# Altium schematic sheet BLDC_Hardware.SchDoc
size B; Date: Not shown in title block; ApprovedBy: Not shown in title block; CheckedBy: Not shown in title block; Author: Not shown in title block; CompanyName: Not shown in title block; DrawnBy: Erhan YILMAZ; Engineer: Not shown in title block; Organization: Not shown in title block; Address1: Not shown in title block; Address2: Not shown in title block; Address3: Not shown in title block; Address4: Not shown in title block; DocumentNumber: 2; Revision: 1; SheetNumber: 2; SheetTotal: 4; PageSetup: Record=PageOptions|CenterHorizontal=True|CenterVertical=True|PrintScale=1.00|XCorrection=1.00|YCorrection=1.00|PrintKind=0|BorderSize=5000000|LeftOffset=0|BottomOffset=0|Orientation=2|PaperLength=1000|PaperWidth=1000|Scale=100|PaperSource=15|PrintQuality=600|MediaType=1|DitherType=10|PaperKind=Letter|PrintScaleMode=1; LogoLocation: C:\Users\erhan\Desktop\emob_bldc\design\hardware\altium\templates\schematic\Beuth-Logo.bmp; SheetTitle: Mechanic Parts; DesignedBy: Erhan YILMAZ; PRJNAME: Beuth EMOB BLDC Controller Derived from TI TIDA-010056; CurrentTime: Not shown in title block; CurrentDate: Not shown in title block; Time: Not shown in title block; DocumentFullPathAndName: Not shown in title block; DocumentName: Not shown in title block; ModifiedDate: Not shown in title block; ImagePath: Not shown in title block
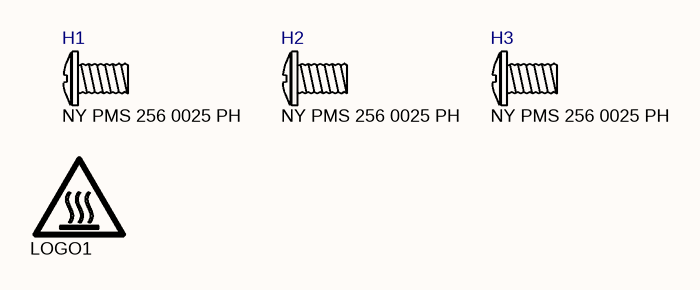
[diagram p0: BLDC_Hardware.SchDoc]

## Parts
H1  NY PMS 256 0025 PH  [NY PMS 256 0025 PH]
H2  NY PMS 256 0025 PH  [NY PMS 256 0025 PH]
H3  NY PMS 256 0025 PH  [NY PMS 256 0025 PH]
LOGO1  CAUTION HOT SURFACE  [IEC_HotSurface_small]  (value not drawn)  (no BOM)

## Notes on the sheet
- Project Name :
- Modified Date :
- Drawn By :
- Revision :
- Sheet
- of
- Designed By :
- Sheet Title :

## Library data of the parts
H1-H3 = NY PMS 256 0025 PH: MACHINE SCREW PAN PHILLIPS 2-56; Manufacturer: B&F Fastener Supply; SymbolCreator: a0412235; SymbolVersion: 2013-06-24; CompType: Screw; PartNumber: NY PMS 256 0025 PH; RoHS: Y; PackageReference: Machine Screw Pan Phillips 2-56; MountType: N/A; ComponentLink1Description: Datasheet Link; ComponentLink1URL: http://www.fasnetdirect.com/refguide/Nylpanms.pdf; Publisher: Texas Instruments; LatestRevisionDate: 2017-05-31; Supplier 1: Digi-Key; Supplier Part Number 1: H530-ND
LOGO1 = IEC_HotSurface: IEC 61010-1 Hot Surface Warning; SymbolCreator: a0412235; SymbolVersion: 2011-08-22; Published: 2009-03-03; Publisher: Texas Instruments; LatestRevisionDate: 2016-03-21